# Altium schematic sheet 7SEG-2.SchDoc
size A4
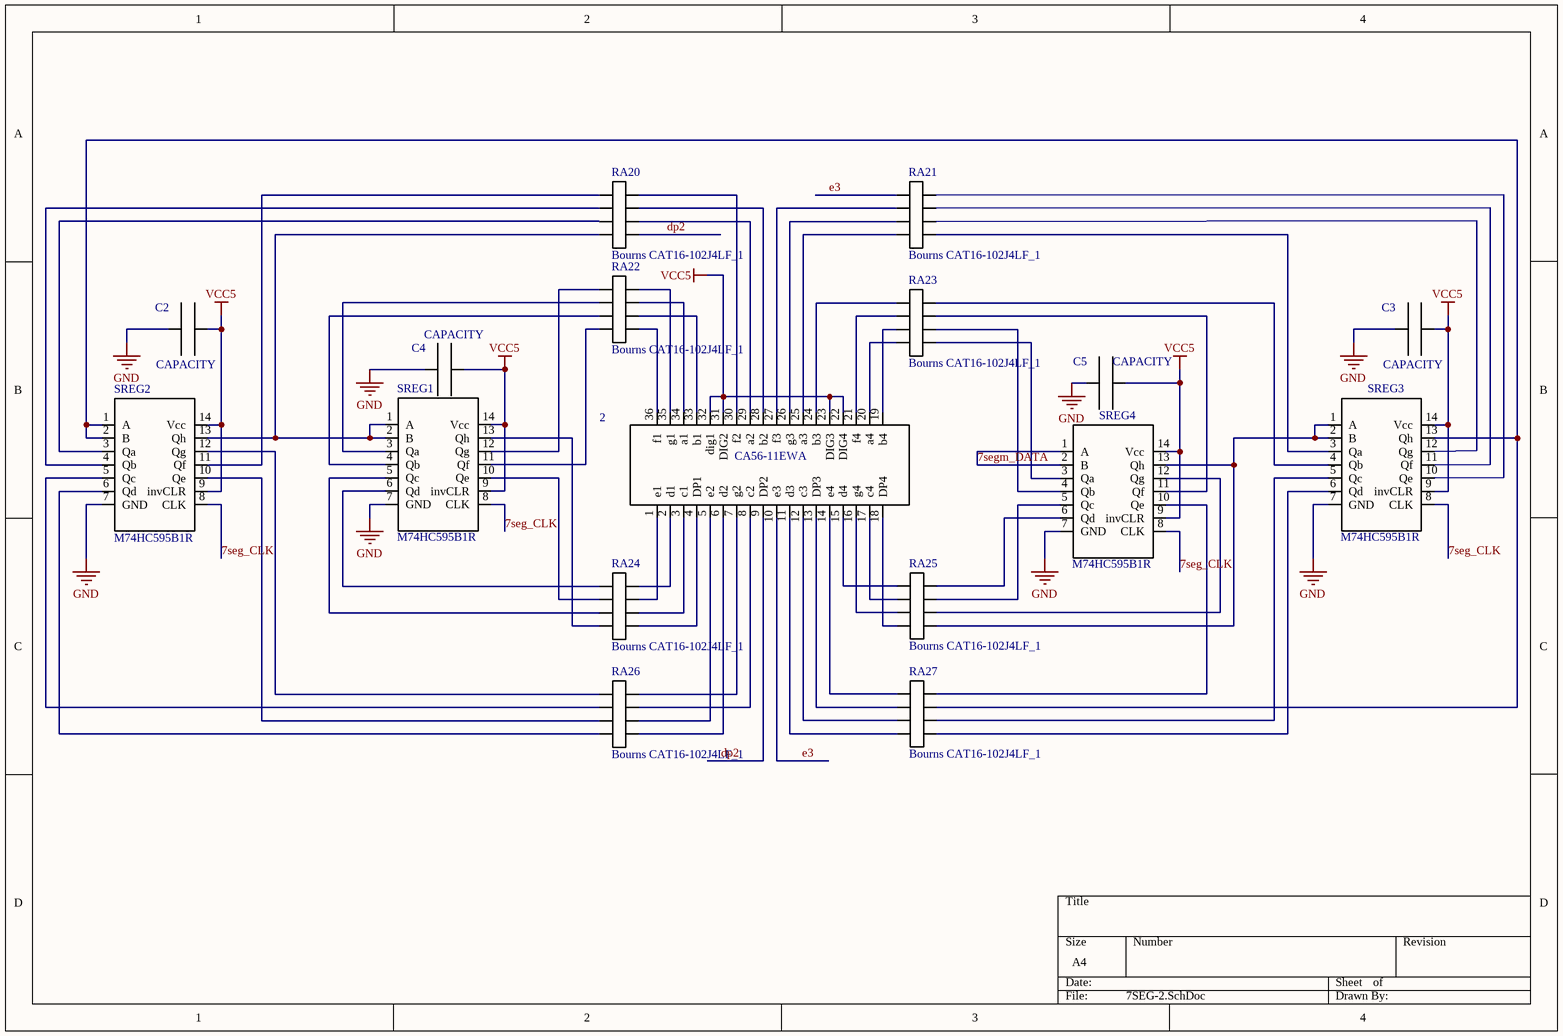
[diagram p0: 7SEG-2.SchDoc]

## Parts
2  CA56-11EWA  [CA56-11EWA]
C2  CAPACITY  [R0805]
C3  CAPACITY  [R0805]
C4  CAPACITY  [R0805]
C5  CAPACITY  [R0805]
RA20  Bourns CAT16-102J4LF_1  [CAT16-102J4LF_2]
RA21  Bourns CAT16-102J4LF_1  [CAT16-102J4LF_2]
RA22  Bourns CAT16-102J4LF_1  [CAT16-102J4LF_2]
RA23  Bourns CAT16-102J4LF_1  [CAT16-102J4LF_2]
RA24  Bourns CAT16-102J4LF_1  [CAT16-102J4LF_2]
RA25  Bourns CAT16-102J4LF_1  [CAT16-102J4LF_2]
RA26  Bourns CAT16-102J4LF_1  [CAT16-102J4LF_2]
RA27  Bourns CAT16-102J4LF_1  [CAT16-102J4LF_2]
SREG1  M74HC595B1R  [SN74HC164DRX]
SREG2  M74HC595B1R  [SN74HC164DRX]
SREG3  M74HC595B1R  [SN74HC164DRX]
SREG4  M74HC595B1R  [SN74HC164DRX]

## Nets
GND: C2.1 C3.1 C4.1 C5.1 SREG1.7(GND) SREG2.7(GND) SREG3.7(GND) SREG4.7(GND)
VCC5: 2.22(DIG4) 2.23(DIG3) 2.31(DIG2) 2.32(dig1) C2.2 C3.2 C4.2 C5.2 SREG1.9(invCLR) SREG1.14(Vcc) SREG2.9(invCLR) SREG2.14(Vcc) SREG3.9(invCLR) SREG3.14(Vcc) SREG4.9(invCLR) SREG4.14(Vcc)
7seg_CLK: SREG1.8(CLK) SREG2.8(CLK) SREG3.8(CLK) SREG4.8(CLK)
7segm_DATA: SREG4.1(A) SREG4.2(B)
dp2: 2.9(DP2) RA20.3
e3: 2.10(e3) RA21.3
Net2_1: 2.1(e1) RA24.6
Net2_2: 2.2(d1) RA24.7
Net2_3: 2.3(c1) RA24.5
Net2_4: 2.4(DP1) RA24.4
Net2_5: 2.5(e2) RA26.6
Net2_6: 2.6(d2) RA26.7
Net2_7: 2.7(g2) RA26.4
Net2_8: 2.8(c2) RA26.5
Net2_11: 2.11(d3) RA27.4
Net2_12: 2.12(c3) RA27.5
Net2_13: 2.13(DP3) RA27.6
Net2_14: 2.14(e4) RA27.7
Net2_15: 2.15(d4) RA25.4
Net2_16: 2.16(g4) RA25.6
Net2_17: 2.17(c4) RA25.5
Net2_18: 2.18(DP4) RA25.7
Net2_19: 2.19(b4) RA23.1
Net2_20: 2.20(a4) RA23.0
Net2_21: 2.21(f4) RA23.2
Net2_24: 2.24(b3) RA23.3
Net2_25: 2.25(a3) RA21.0
Net2_26: 2.26(g3) RA21.1
Net2_27: 2.27(f3) RA21.2
Net2_28: 2.28(b2) RA20.1
Net2_29: 2.29(a2) RA20.2
Net2_30: 2.30(f2) RA20.0
Net2_33: 2.33(b1) RA22.1
Net2_34: 2.34(a1) RA22.2
Net2_35: 2.35(g1) RA22.3
Net2_36: 2.36(f1) RA22.0
NetRA20_4: RA20.4 SREG1.1(A) SREG1.2(B) SREG2.13(Qh)
NetRA20_5: RA20.5 SREG2.3(Qa)
NetRA20_6: RA20.6 SREG2.4(Qb)
NetRA20_7: RA20.7 SREG2.11(Qf)
NetRA21_4: RA21.4 SREG3.10(Qe)
NetRA21_5: RA21.5 SREG3.11(Qf)
NetRA21_6: RA21.6 SREG3.12(Qg)
NetRA21_7: RA21.7 SREG3.3(Qa)
NetRA22_4: RA22.4 SREG1.12(Qg)
NetRA22_5: RA22.5 SREG1.3(Qa)
NetRA22_6: RA22.6 SREG1.4(Qb)
NetRA22_7: RA22.7 SREG1.11(Qf)
NetRA23_4: RA23.4 SREG3.4(Qb)
NetRA23_5: RA23.5 SREG4.11(Qf)
NetRA23_6: RA23.6 SREG4.4(Qb)
NetRA23_7: RA23.7 SREG4.3(Qa)
NetRA24_0: RA24.0 SREG1.6(Qd)
NetRA24_1: RA24.1 SREG1.10(Qe)
NetRA24_2: RA24.2 SREG1.5(Qc)
NetRA24_3: RA24.3 SREG1.13(Qh)
NetRA25_0: RA25.0 SREG3.1(A) SREG3.2(B) SREG4.13(Qh)
NetRA25_1: RA25.1 SREG4.12(Qg)
NetRA25_2: RA25.2 SREG4.5(Qc)
NetRA25_3: RA25.3 SREG4.6(Qd)
NetRA26_0: RA26.0 SREG2.6(Qd)
NetRA26_1: RA26.1 SREG2.10(Qe)
NetRA26_2: RA26.2 SREG2.5(Qc)
NetRA26_3: RA26.3 SREG2.12(Qg)
NetRA27_0: RA27.0 SREG4.10(Qe)
NetRA27_1: RA27.1 SREG2.1(A) SREG2.2(B) SREG3.13(Qh)
NetRA27_2: RA27.2 SREG3.5(Qc)
NetRA27_3: RA27.3 SREG3.6(Qd)